# EAGLE design PCB-GONIO-V1.1 (EAGLE 9.6.2)
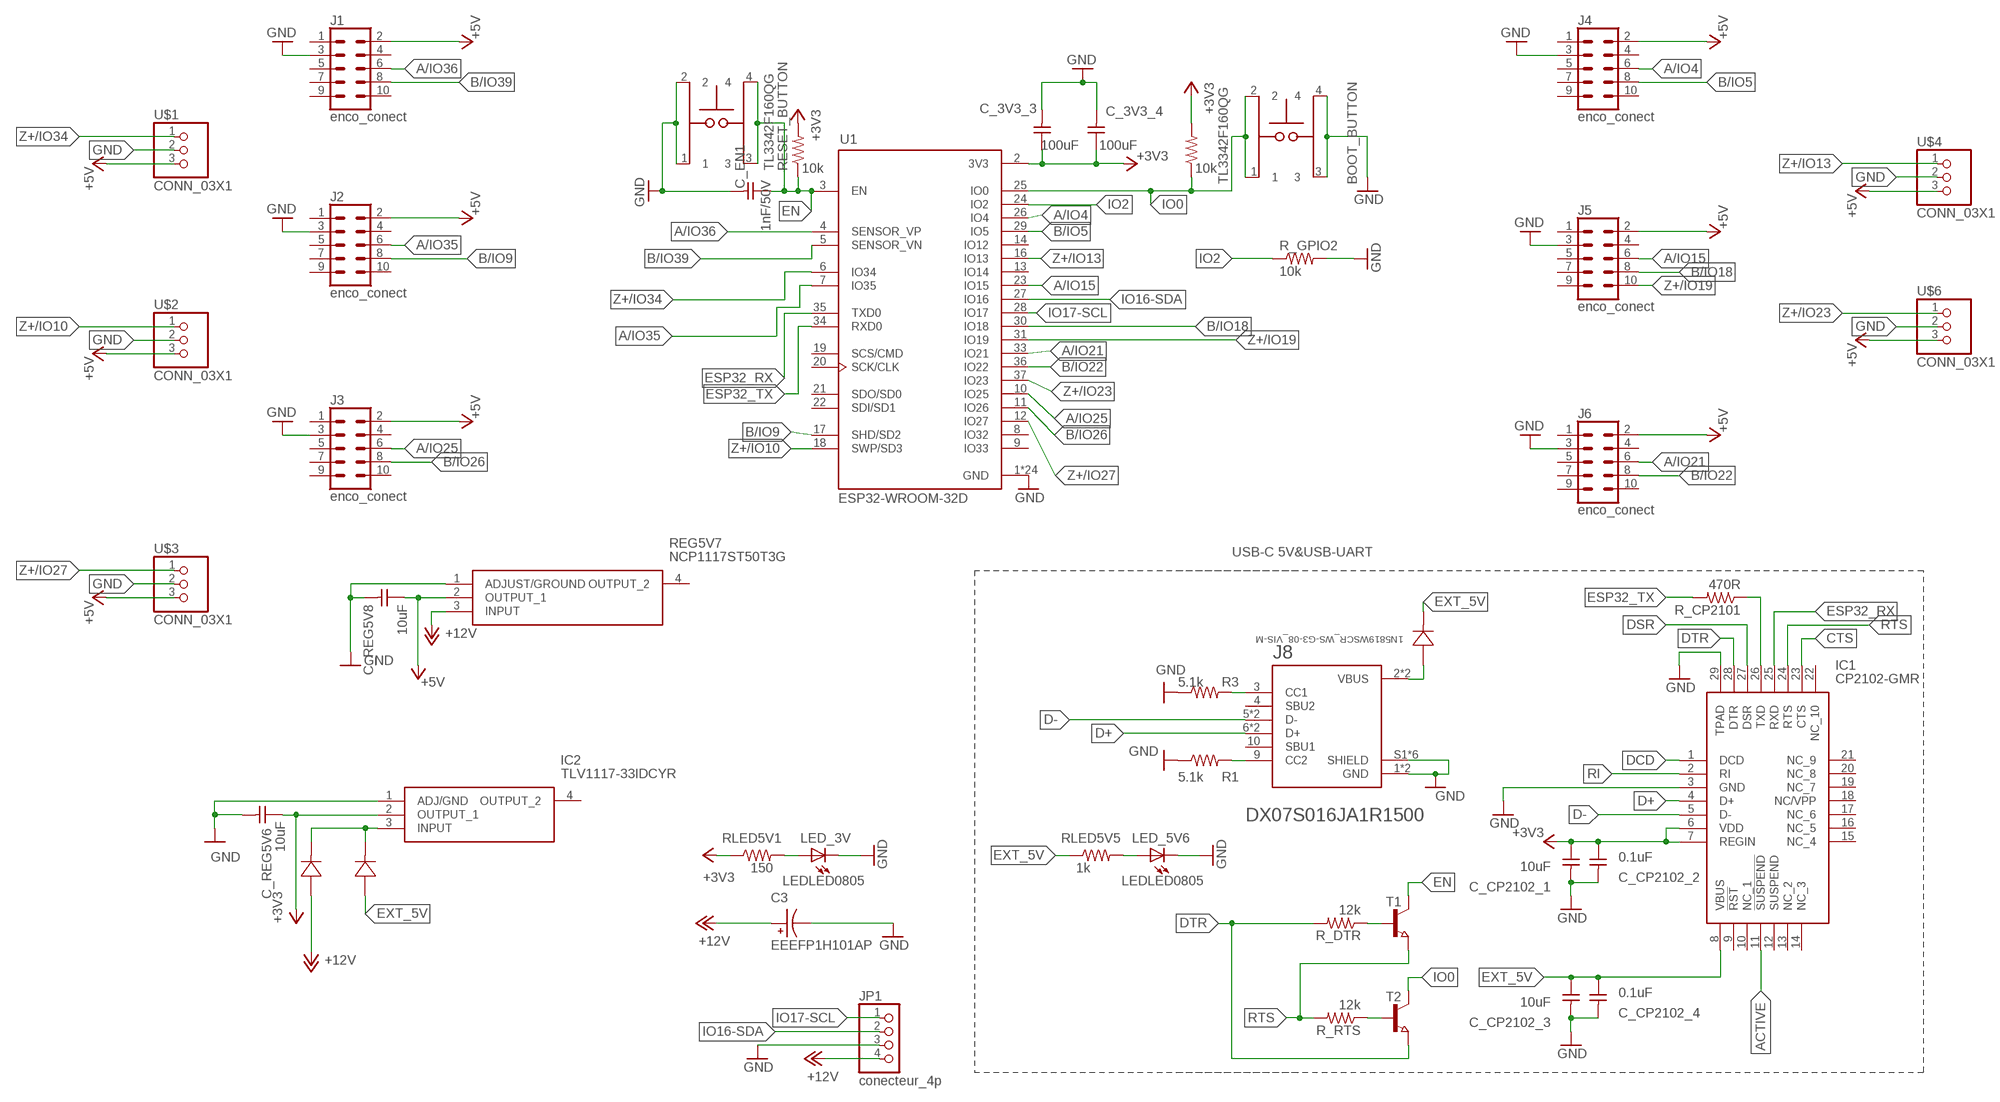
[diagram p0: schematic, sheet 1]

## Parts
BOOT_BUTTON  TL3342F160QG  [SW_TL3342F160QG]
C3  EEEFP1H101AP  [CAP_EEEFP1H101AP]
C_3V3_3  100uF  CAP_UNPOLARIZEDFAB  [C1206FAB]
C_3V3_4  100uF  CAP_UNPOLARIZEDFAB  [C1206FAB]
C_CP2102_1  10uF  CAP_UNPOLARIZEDFAB  [C1206FAB]
C_CP2102_2  0.1uF  CAP_UNPOLARIZEDFAB  [C1206FAB]
C_CP2102_3  10uF  CAP_UNPOLARIZEDFAB  [C1206FAB]
C_CP2102_4  0.1uF  CAP_UNPOLARIZEDFAB  [C1206FAB]
C_EN1  1nF/50V  CAP_UNPOLARIZEDFAB  [C1206FAB]
C_REG5V6  10uF  CAP_UNPOLARIZEDFAB  [C1206FAB]
C_REG5V8  10uF  CAP_UNPOLARIZEDFAB  [C1206FAB]
CR1  1N5819WSCR_WS-G3-08_VIS-M  [CR_WS-G3-08_VIS-M]
CR2  1N5819WSCR_WS-G3-08_VIS-M  [CR_WS-G3-08_VIS-M]
CR3  1N5819WSCR_WS-G3-08_VIS-M  [CR_WS-G3-08_VIS-M]
IC1  CP2102-GMR  [QFN50P500X500X100-29N]
IC2  TLV1117-33IDCYR  [SOT230P700X180-4N]
J1  enco_conect  CONN_05X2SHD  [2X5-SHROUDED]
J2  enco_conect  CONN_05X2SHD  [2X5-SHROUDED]
J3  enco_conect  CONN_05X2SHD  [2X5-SHROUDED]
J4  enco_conect  CONN_05X2SHD  [2X5-SHROUDED]
J5  enco_conect  CONN_05X2SHD  [2X5-SHROUDED]
J6  enco_conect  CONN_05X2SHD  [2X5-SHROUDED]
J8  DX07S016JA1R1500  [JAE_DX07S016JA1R1500]
JP1  conecteur_4p  PINHD-1X4  [1X04]
LED_3V  LEDLED0805  [LEDC2012X90N]
LED_5V6  LEDLED0805  [LEDC2012X90N]
R1  5.1k  R-US_R1206W  [R1206W]
R3  5.1k  R-US_R1206W  [R1206W]
R_CP2101  470R  R1206FAB  [R1206FAB]
R_DTR  12k  R1206FAB  [R1206FAB]
R_GPIO2  10k  R1206FAB  [R1206FAB]
R_PULL_UP1  10k  R1206FAB  [R1206FAB]
R_PULL_UP3  10k  R1206FAB  [R1206FAB]
R_RTS  12k  R1206FAB  [R1206FAB]
REG5V7  NCP1117ST50T3G  [SOT230P700X180-4N]
RESET_BUTTON  TL3342F160QG  [SW_TL3342F160QG]
RLED5V1  150  R1206FAB  [R1206FAB]
RLED5V5  1k  R1206FAB  [R1206FAB]
T1  T_NPN_S8050-J3Y_CHANGJ_SOT23-BEC  [SOT23]
T2  T_NPN_S8050-J3Y_CHANGJ_SOT23-BEC  [SOT23]
U1  ESP32-WROOM-32D  [MODULE_ESP32-WROOM-32D]
U$1  CONN_03X1  [1X3]
U$2  CONN_03X1  [1X3]
U$3  CONN_03X1  [1X3]
U$4  CONN_03X1  [1X3]
U$6  CONN_03X1  [1X3]

## Nets
+3V3: C_3V3_3.1 C_3V3_4.1 C_CP2102_1.1 C_CP2102_2.1 C_REG5V6.1 IC1.6(VDD) IC1.7(REGIN) IC2.2(OUTPUT_1) R_PULL_UP1.2 R_PULL_UP3.2 RLED5V1.1 U1.2(3V3)
+5V: C_REG5V8.1 J1.2 J2.2 J3.2 J4.2 J5.2 J6.2 REG5V7.2(OUTPUT_1) U$1.3 U$2.3 U$3.3 U$4.3 U$6.3
+12V: C3.1 CR2.2 JP1.4 REG5V7.3(INPUT)
A/IO4: J4.6 U1.26(IO4)
A/IO15: J5.6 U1.23(IO15)
A/IO21: J6.6 U1.33(IO21)
A/IO25: J3.6 U1.10(IO25)
A/IO35: J2.6 U1.7(IO35)
A/IO36: J1.6 U1.4(SENSOR_VP)
ACTIVE: IC1.11(!SUSPEND)
B/IO5: J4.8 U1.29(IO5)
B/IO9: J2.8 U1.17(SHD/SD2)
B/IO18: J5.8 U1.30(IO18)
B/IO22: J6.8 U1.36(IO22)
B/IO26: J3.8 U1.11(IO26)
B/IO39: J1.8 U1.5(SENSOR_VN)
CTS: IC1.23(CTS)
D+: IC1.4(D+) J8.6(D+) J8.7(D+)
D-: IC1.5(D-) J8.5(D-) J8.8(D-)
DCD: IC1.1(DCD)
DSR: IC1.27(DSR)
DTR: IC1.28(DTR) R_DTR.2 T2.2(E)
EN: C_EN1.1 R_PULL_UP1.1 RESET_BUTTON.3 RESET_BUTTON.4 T1.3(C) U1.3(EN)
ESP32_RX: IC1.25(RXD) U1.35(TXD0)
ESP32_TX: R_CP2101.2 U1.34(RXD0)
EXT_5V: C_CP2102_3.1 C_CP2102_4.1 CR1.1 CR3.2 IC1.8(VBUS) RLED5V5.1
GND: BOOT_BUTTON.3 BOOT_BUTTON.4 C3.2 C_3V3_3.2 C_3V3_4.2 C_CP2102_1.2 C_CP2102_2.2 C_CP2102_3.2 C_CP2102_4.2 C_EN1.2 C_REG5V6.2 C_REG5V8.2 IC1.3(GND) IC1.29(TPAD) IC2.1(ADJ/GND) J1.3 J2.3 J3.3 J4.3 J5.3 J6.3 J8.1(GND) J8.12(GND) J8.S1(SHIELD) J8.S2(SHIELD) J8.S3(SHIELD) J8.S4(SHIELD) J8.S5(SHIELD) J8.S6(SHIELD) JP1.3 LED_3V.1(C) LED_5V6.1(C) R1.1 R3.1 R_GPIO2.2 REG5V7.1(ADJUST/GROUND) RESET_BUTTON.1 RESET_BUTTON.2 U1.1(GND) U1.15(GND) U1.38(GND) U1.39_1(GND) U1.39_2(GND) U1.39_3(GND) U1.39_4(GND) U1.39_5(GND) U1.39_6(GND) U1.39_7(GND) U1.39_8(GND) U1.39_9(GND) U1.39_10(GND) U1.39_11(GND) U1.39_12(GND) U1.39_13(GND) U1.39_14(GND) U1.39_15(GND) U1.39_16(GND) U1.39_17(GND) U1.39_18(GND) U1.39_19(GND) U1.39_20(GND) U1.39_21(GND) U$1.2 U$2.2 U$3.2 U$4.2 U$6.2
GND1: J8.9(CC2) R1.2
GND3: J8.3(CC1) R3.2
IO0: BOOT_BUTTON.1 BOOT_BUTTON.2 R_PULL_UP3.1 T2.3(C) U1.25(IO0)
IO2: R_GPIO2.1 U1.24(IO2)
IO16-SDA: JP1.2 U1.27(IO16)
IO17-SCL: JP1.1 U1.28(IO17)
N$1: CR2.1 CR3.1 IC2.3(INPUT)
N$2: LED_3V.2(A) RLED5V1.2
N$3: CR1.2 J8.2(VBUS) J8.11(VBUS)
N$8: IC1.26(TXD) R_CP2101.1
N$9: R_DTR.1 T1.1(B)
N$10: R_RTS.1 T2.1(B)
N$19: LED_5V6.2(A) RLED5V5.2
RI: IC1.2(RI)
RTS: IC1.24(RTS) R_RTS.2 T1.2(E)
Z+/IO10: U1.18(SWP/SD3) U$2.1
Z+/IO13: U1.16(IO13) U$4.1
Z+/IO19: J5.10 U1.31(IO19)
Z+/IO23: U1.37(IO23) U$6.1
Z+/IO27: U1.12(IO27) U$3.1
Z+/IO34: U1.6(IO34) U$1.1
Unconnected: IC1.9(!RST) IC1.10(NC_1) IC1.12(SUSPEND) IC1.13(NC_2) IC1.14(NC_3) IC1.15(NC_4) IC1.16(NC_5) IC1.17(NC_6) IC1.18(NC/VPP) IC1.19(NC_7) IC1.20(NC_8) IC1.21(NC_9) IC1.22(NC_10) IC2.4(OUTPUT_2) J1.1 J1.4 J1.5 J1.7 J1.9 J1.10 J2.1 J2.4 J2.5 J2.7 J2.9 J2.10 J3.1 J3.4 J3.5 J3.7 J3.9 J3.10 J4.1 J4.4 J4.5 J4.7 J4.9 J4.10 J5.1 J5.4 J5.5 J5.7 J5.9 J6.1 J6.4 J6.5 J6.7 J6.9 J6.10 J8.4(SBU2) J8.10(SBU1) REG5V7.4(OUTPUT_2) U1.8(IO32) U1.9(IO33) U1.13(IO14) U1.14(IO12) U1.19(SCS/CMD) U1.20(SCK/CLK) U1.21(SDO/SD0) U1.22(SDI/SD1)

## Notes on the sheet
- USB-C 5V&USB-UART

## Library data of the parts
BOOT_BUTTON RESET_BUTTON = TL3342F160QG:TL3342F160QG: Check availability <https://pricing.snapeda.com/parts/TL3342F160QG/E-Switch/view-part?ref=eda>; AVAILABILITY: In Stock; CHECK_PRICES: https://www.snapeda.com/parts/TL3342F160QG/E-Switch/view-part/?ref=eda; DESCRIPTION: Tactile Switch SPST-NO Top Actuated Surface Mount; MF: E-Switch; MP: TL3342F160QG; PACKAGE: None; PRICE: None; SNAPEDA_LINK: https://www.snapeda.com/parts/TL3342F160QG/E-Switch/view-part/?ref=snap
C3 = EEEFP1H101AP:EEEFP1H101AP; CHECK_PRICES: https://www.snapeda.com/parts/EEEFP1H101AP/Panasonic/view-part/?ref=eda; DESCRIPTION: 100µF 50V Aluminum Electrolytic Capacitors Radial, Can - SMD 180mOhm @ 100kHz 2000 Hrs @ 105°C; DIGIKEY_PART_NUMBER: P19726TR-ND; MF: Panasonic; MP: EEEFP1H101AP; PACKAGE: RADIAL-2 Panasonic; SNAPEDA_LINK: https://www.snapeda.com/parts/EEEFP1H101AP/Panasonic/view-part/?ref=snap
C_3V3_3 C_3V3_4 C_CP2102_1-C_CP2102_4 C_EN1 C_REG5V6 C_REG5V8 = fab:CAP_UNPOLARIZED
CR1-CR3 = 1N4148WS:1N5819WS; COPYRIGHT: Copyright (C) 2022 Ultra Librarian. All rights reserved.; DIGI-KEY_PART_NUMBER_1: 1N4148WS-G3-08GITR-ND; DIGI-KEY_PART_NUMBER_2: 1N4148WS-G3-08GICT-ND; DIGI-KEY_PART_NUMBER_3: 1N4148WS-G3-08GIDKR-ND; MANUFACTURER_PART_NUMBER: 1N4148WS-G3-08; MFR_NAME: Vishay
IC1 = SamacSys_Parts:CP2102-GMR: I/O Controller Interface IC USB-TO-UART BRIDGE, qfn-28 Source: Datasheet <https://www.silabs.com/Support Documents/TechnicalDocs/CP2102-9.pdf>; DESCRIPTION: I/O Controller Interface IC USB-TO-UART BRIDGE, qfn-28; HEIGHT: 1mm; MANUFACTURER_NAME: Silicon Labs; MANUFACTURER_PART_NUMBER: CP2102-GMR; MOUSER_PART_NUMBER: 634-CP2102-GMR; MOUSER_PRICE-STOCK: https://www.mouser.co.uk/ProductDetail/Silicon-Labs/CP2102-GMR?qs=cNyzPCcHMUWu%2FiPhR8KQAw%3D%3D
IC2 = TLV1117-33IDCYR:TLV1117-33IDCYR: Single Output LDO, 800mA, Fixed and Adj., Internal Current limit, Thermal Overload Protection Source: Datasheet <https://datasheet.datasheetarchive.com/originals/distributors/Datasheets-DGA25/1767134.pdf>; DESCRIPTION: Single Output LDO, 800mA, Fixed and Adj., Internal Current limit, Thermal Overload Protection; HEIGHT: 1.8mm; MANUFACTURER_NAME: Texas Instruments; MANUFACTURER_PART_NUMBER: TLV1117-33IDCYR; MOUSER_PART_NUMBER: 595-TLV1117-33IDCYR; MOUSER_PRICE-STOCK: https://www.mouser.co.uk/ProductDetail/Texas-Instruments/TLV1117-33IDCYR?qs=p6lVfQR1GSoKgp3tAXcW5w%3D%3D
J1-J6 = fab:CONN_05X2: Multi connection point. Often used as Generic Header-pin footprint for 0.1 inch spaced/style header connections For AVR SPI programming port, see special device with nice symbol: "AVR_SPI_PROG_5x2.dev" You can populate with any combo of single row headers, but if you'd like an exact match, check these: 2x5 AVR ICSP Male Header <https://www.sparkfun.com/products/778> (PRT-00778) 2x5 Pin Shrouded Header <https://www.sparkfun.com/products/8506> (PRT-08506) On any of the 0.1 inch spaced packages, you can populate with these: Break Away Headers - Straight <https://www.sparkfun.com/products/116> (PRT-00116) Break Away Male Headers - Right Angle <https://www.sparkfun.com/products/553> (PRT-00553) Female Headers <https://www.sparkfun.com/products/115> (PRT-00115) Break Away Headers - Machine Pin <https://www.sparkfun.com/products/117> (PRT-00117) Break Away Female Headers - Swiss Machine Pin <https://www.sparkfun.com/products/743> (PRT-00743) Special note: the shrouded connector mates well with our 5x2 ribbon cables: 2x5 Pin IDC Ribbon Cable <https://www.sparkfun.com/products/8535> (PRT-08535); PROD_ID: CONN-08671; SF_ID: PRT-08506
J8 = DX07S016JA1R1500 (2):DX07S016JA1R1500: Check availability <https://pricing.snapeda.com/parts/DX07S016JA1R1500/Japan%20Aviation%20Electronics/view-part?ref=eda>; AVAILABILITY: In Stock; CHECK_PRICES: https://www.snapeda.com/parts/DX07S016JA1R1500/JAE+Electronics/view-part/?ref=eda; DESCRIPTION: USB-C (USB TYPE-C) USB 2.0 Receptacle Connector 24 (16+8 Dummy) Position Surface Mount, Right Angle; Through Hole; MF: Japan Aviation Electronics; MP: DX07S016JA1R1500; PACKAGE: None; PRICE: None; SNAPEDA_LINK: https://www.snapeda.com/parts/DX07S016JA1R1500/JAE+Electronics/view-part/?ref=snap
JP1 = pinhead:PINHD-1X4: PIN HEADER
LED_3V LED_5V6 = fab:LED: LED
R1 R3 = rcl:R-US_: RESISTOR, American symbol; SPICEPREFIX: R
R_CP2101 R_DTR R_GPIO2 R_PULL_UP1 R_PULL_UP3 R_RTS RLED5V1 RLED5V5 = fab:R: Resistor (US Symbol) Variants with postfix FAB are widened to allow the routing of internal traces
REG5V7 = SamacSys_Parts:NCP1117ST50T3G: ON SEMICONDUCTOR - NCP1117ST50T3G - LDO, REG, 20VIN, 1A, 5V, 1%, SOT223-3 Source: Datasheet <http://uk.rs-online.com/web/p/products/8022130P>; ALLIED_NUMBER: 70466898; DESCRIPTION: ON SEMICONDUCTOR - NCP1117ST50T3G - LDO, REG, 20VIN, 1A, 5V, 1%, SOT223-3; HEIGHT: 1.8mm; LCSC_PART: C17314; MANUFACTURER_NAME: ON Semiconductor; MANUFACTURER_PART_NUMBER: NCP1117ST50T3G; RS_PART_NUMBER: 8022130P; RS_PRICE-STOCK: http://uk.rs-online.com/web/p/products/8022130P
T1 T2 = JLC PCB Basic Parts_loc:T_NPN_: Transistor NPN; LCSC_DATASHEET: https://datasheet.lcsc.com/lcsc/1810161230_Changjiang-Electronics-Tech--CJ-S8050-J3Y_C2146.pdf; LCSC_PART: C2146; LCSC_ROTATION_CCW: 180; LCSC_STOCK: 382366; PROPERTIES: 25V 300mW 500mA 200@50mA,1V 150MHz 600mV@500mA,50mA NPN +150°C@(Tj) SOT-23(SOT-23-3) Bipolar Transistors - BJT ROHS
U1 = ESP32-WROOM-32D:ESP32-WROOM-32D: Check availability <https://pricing.snapeda.com/parts/ESP32-WROOM-32D/Espressif%20Systems/view-part?ref=eda>; AVAILABILITY: In Stock; CHECK_PRICES: https://www.snapeda.com/parts/ESP32-WROOM-32D/Espressif+Systems/view-part/?ref=eda; DESCRIPTION: Multiprotocol Modules SMD Module, ESP32-D0WD, 32Mbits SPI flash, UART mode, PCB antenna; MF: Espressif Systems; MP: ESP32-WROOM-32D; PACKAGE: Non Standard Espressif Systems; PRICE: None; SNAPEDA_LINK: https://www.snapeda.com/parts/ESP32-WROOM-32D/Espressif+Systems/view-part/?ref=snap
U$1-U$4 U$6 = fab:CONN_03X1

## Board
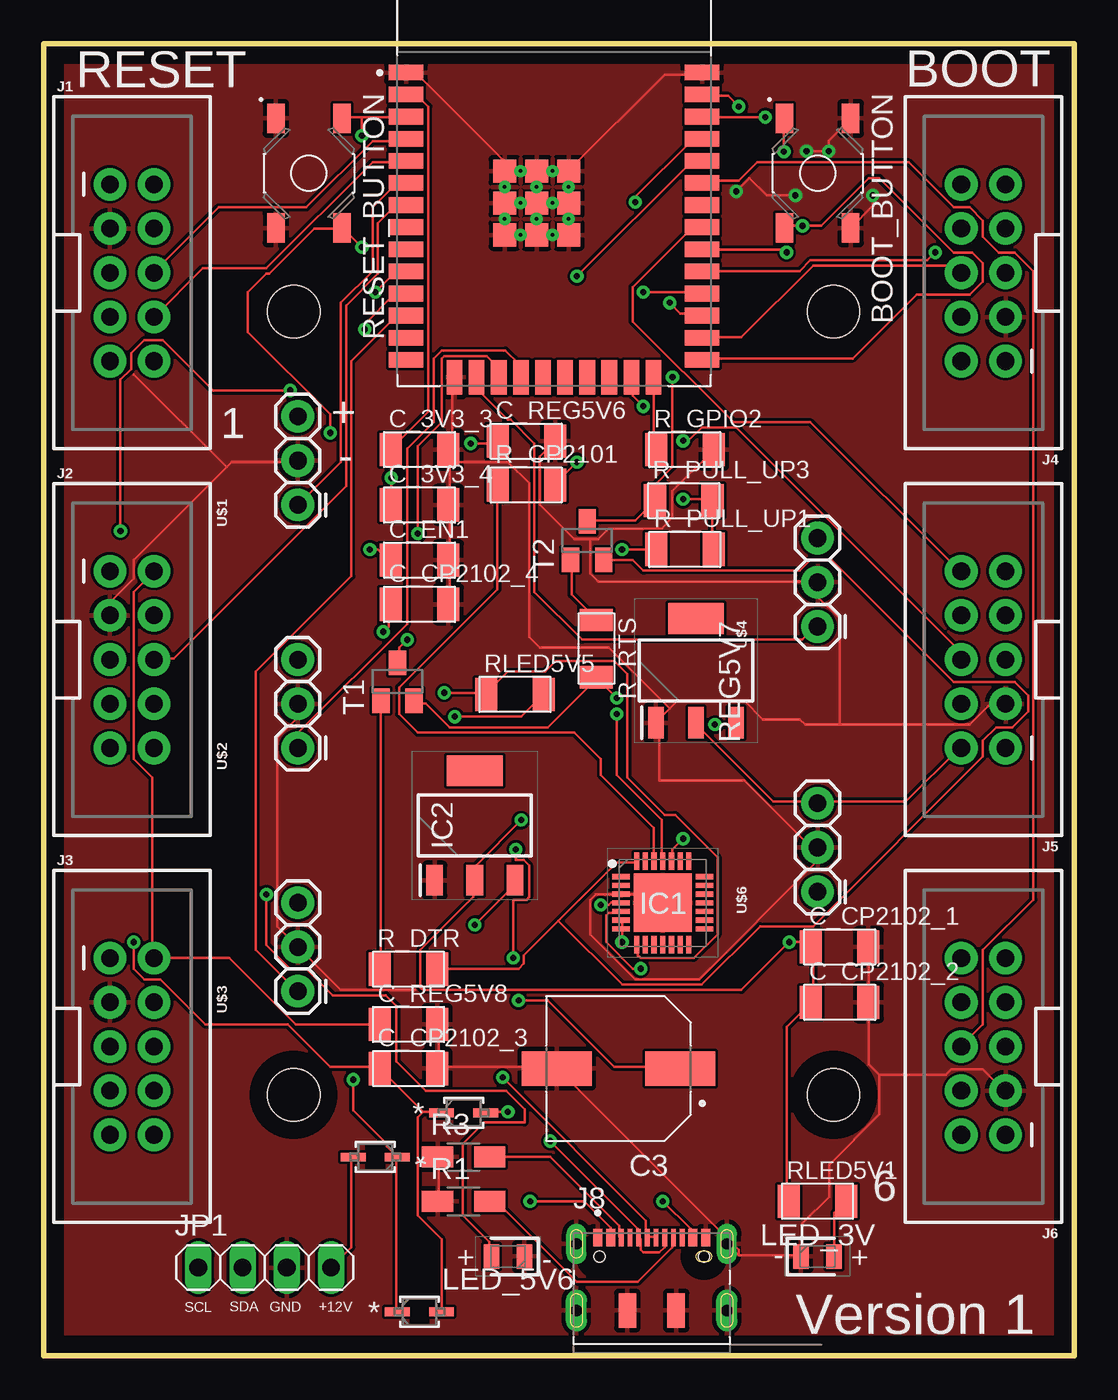
[diagram p1: board, top side]
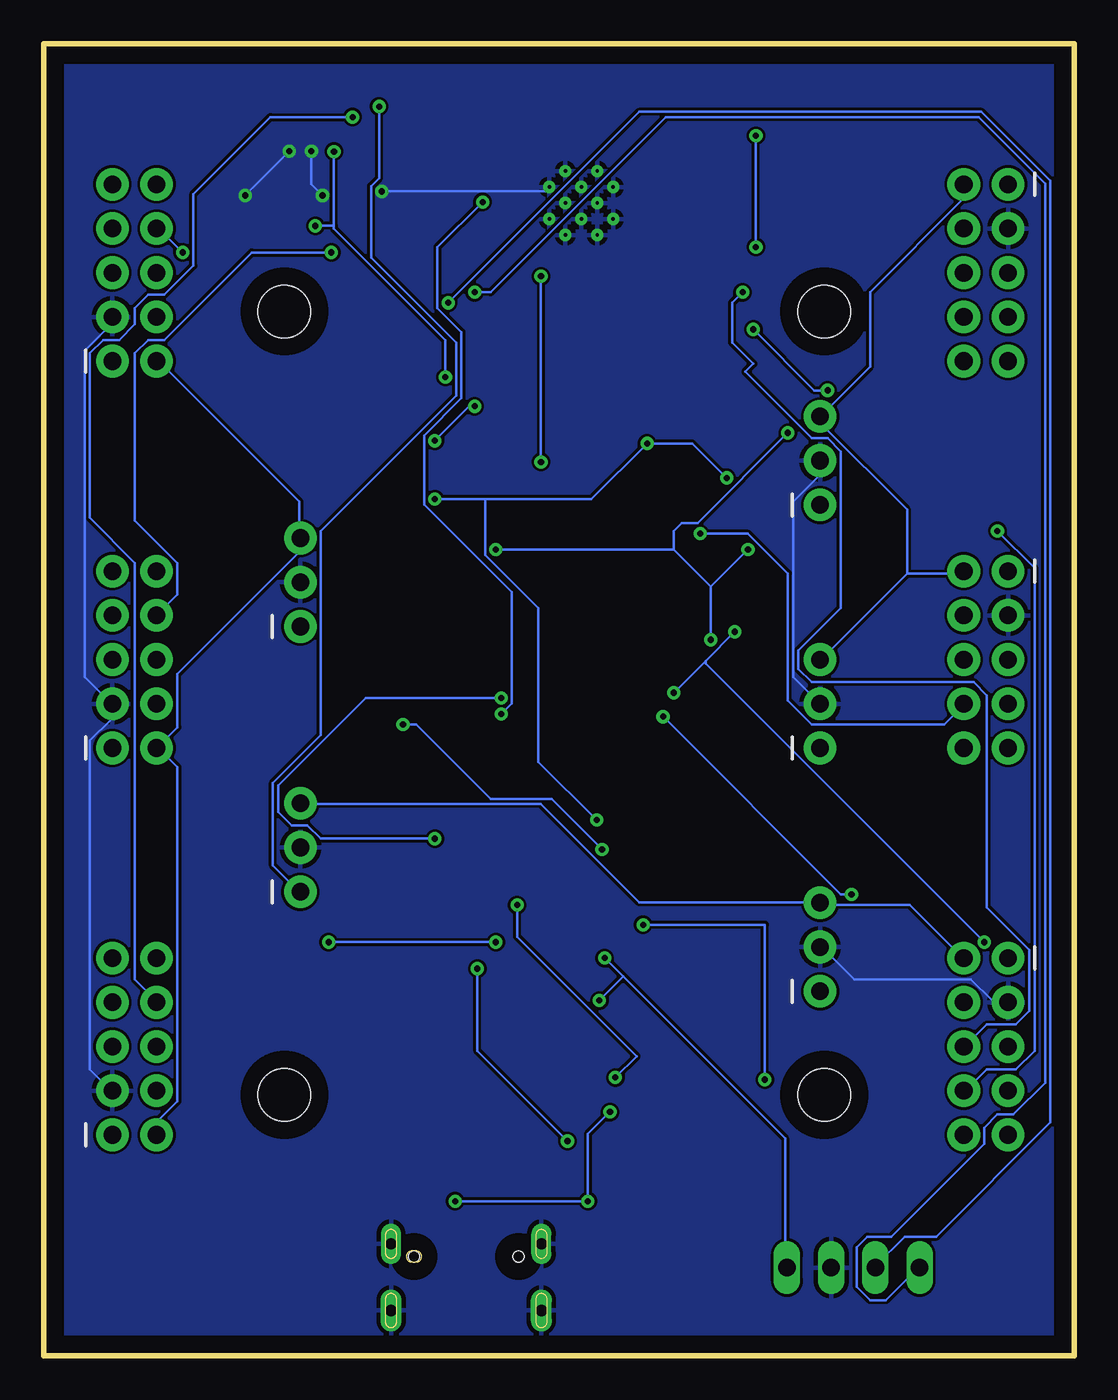
[diagram p2: board, bottom side, seen from below]

Size 59.2 x 75.4 mm. Coordinates in mm from the lower left corner, seen from the top.
Outline: 0,0 59.2,0 59.2,75.4 0,75.4 0,0
Copper layers (1*16): Top 0.035mm / dielectric 1.5mm / Bottom 0.035mm
Design rules "default": minimum track width 6mil, minimum drill 0.35mm, track to track 6mil, track to pad 6mil, pad to pad 6mil, via to via 6mil, smd to smd 6mil, copper to edge 40mil, drill to drill 6mil, minimum pad ring 10mil, minimum via ring 8mil, stop-mask expansion 4mil, vias tented up to drill 0mil, thermal gap 10mil
Holes 3 mm at 14.37,15 14.37,60 45.37,60 45.37,15

### Footprints (pad centres in the part's own frame; a part is rotated, then mirrored left to right if it is on the bottom)
SW_TL3342F160QG = smd 1.7 x 1: 1 -3.15,-1.9; 2 3.15,-1.9; 3 -3.15,1.9; 4 3.15,1.9
CAP_EEEFP1H101AP = smd 4 x 2: 1 -3.55,0; 2 3.55,0
C1206FAB = smd 1.27 x 1.905: 1 -1.651,0; 2 1.651,0
CR_WS-G3-08_VIS-M = smd 1.422 x 0.508: 1 -1.27,0; 2 1.27,0
QFN50P500X500X100-29N = smd 1 x 0.3: 1 -2.4,1.5; 2 -2.4,1; 3 -2.4,0.5; 4 -2.4,0; 5 -2.4,-0.5; 6 -2.4,-1; 7 -2.4,-1.5; 15 2.4,-1.5; 16 2.4,-1; 17 2.4,-0.5; 18 2.4,0; 19 2.4,0.5; 20 2.4,1; 21 2.4,1.5 | smd 0.3 x 1: 8 -1.5,-2.4; 9 -1,-2.4; 10 -0.5,-2.4; 11 0,-2.4; 12 0.5,-2.4; 13 1,-2.4; 14 1.5,-2.4; 22 1.5,2.4; 23 1,2.4; 24 0.5,2.4; 25 0,2.4; 26 -0.5,2.4; 27 -1,2.4; 28 -1.5,2.4 | smd 3.35 x 3.35: 29 0,0
SOT230P700X180-4N = smd 1.75 x 0.95: 1 -3.15,2.3; 2 -3.15,0; 3 -3.15,-2.3 | smd 1.75 x 3.2: 4 3.15,0
2X5-SHROUDED = drill 1.016 pad 1.88: 1 -1.27,5.08; 2 1.27,5.08; 3 -1.27,2.54; 4 1.27,2.54; 5 -1.27,0; 6 1.27,0; 7 -1.27,-2.54; 8 1.27,-2.54; 9 -1.27,-5.08; 10 1.27,-5.08
JAE_DX07S016JA1R1500 = smd 0.52 x 1: 1 -3.1,1.1; 2 -2.35,1.1; 11 2.35,1.1; 12 3.1,1.1 | smd 0.27 x 1: 3 -1.75,1.1; 4 -1.25,1.1; 5 -0.75,1.1; 6 -0.25,1.1; 7 0.25,1.1; 8 0.75,1.1; 9 1.25,1.1; 10 1.75,1.1 | smd 1 x 2: S1 -1.4,-3.1; S2 1.4,-3.1 | drill 0.65 long: S3 -4.32,0.725; S4 4.32,0.725 | drill 0.65 pad 1.2 long: S5 -4.32,-3.1; S6 4.32,-3.1 | hole 0.6: 3,0 | hole 0.63: 3,0; -3,0
1X04 = drill 1.016 long: 1 -3.81,0; 2 -1.27,0; 3 1.27,0; 4 3.81,0
LEDC2012X90N = smd 0.9 x 1.4: 1 -0.95,0; 2 0.95,0
R1206W = smd 1.8 x 1.2: 1 -1.499,0; 2 1.499,0
R1206FAB = smd 1.27 x 1.905: 1 -1.651,0; 2 1.651,0
SOT230P700X180-4N' = smd 1.8 x 0.9: 1 -3,2.3; 2 -3,0; 3 -3,-2.3 | smd 1.8 x 3.2: 4 3,0
SOT23 = smd 1.4 x 1: 1 -1.1,0.95; 2 -1.1,-0.95; 3 1.1,0
MODULE_ESP32-WROOM-32D = smd 2 x 0.9: 1 -8.5,5.26; 2 -8.5,3.99; 3 -8.5,2.72; 4 -8.5,1.45; 5 -8.5,0.18; 6 -8.5,-1.09; 7 -8.5,-2.36; 8 -8.5,-3.63; 9 -8.5,-4.9; 10 -8.5,-6.17; 11 -8.5,-7.44; 12 -8.5,-8.71; 13 -8.5,-9.98; 14 -8.5,-11.25; 25 8.5,-11.25; 26 8.5,-9.98; 27 8.5,-8.71; 28 8.5,-7.44; 29 8.5,-6.17; 30 8.5,-4.9; 31 8.5,-3.63; 32 8.5,-2.36; 33 8.5,-1.09; 34 8.5,0.18; 35 8.5,1.45; 36 8.5,2.72; 37 8.5,3.99; 38 8.5,5.26 | smd 0.9 x 2: 15 -5.715,-12.25; 16 -4.445,-12.25; 17 -3.175,-12.25; 18 -1.905,-12.25; 19 -0.635,-12.25; 20 0.635,-12.25; 21 1.905,-12.25; 22 3.175,-12.25; 23 4.445,-12.25; 24 5.715,-12.25 | smd 1.33 x 1.33: 39_1 -2.835,-0.405; 39_2 -1,-0.405; 39_3 0.835,-0.405; 39_4 -2.835,-2.24; 39_5 -1,-2.24; 39_6 0.835,-2.24; 39_7 -2.835,-4.075; 39_8 -1,-4.075; 39_9 0.835,-4.075 | drill 0.2 pad 0.3: 39_10 -1.917,-0.405; 39_11 -0.083,-0.405; 39_12 -2.835,-1.323; 39_13 -1,-1.323; 39_14 0.835,-1.323; 39_15 -1.917,-2.24; 39_16 -0.083,-2.24; 39_17 -2.835,-3.158; 39_18 -1,-3.158; 39_19 0.835,-3.158; 39_20 -1.917,-4.075; 39_21 -0.083,-4.075
1X3 = drill 1.016 pad 1.88: 1 0,0; 2 2.54,0; 3 5.08,0

### Placement (x,y rotation side)
BOOT_BUTTON  44.45,67.94 270 top
C3  33.02,16.51 180 top
C_3V3_3  21.59,52.07 0 top
C_3V3_4  21.59,48.9 0 top
C_CP2102_1  45.72,23.5 0 top
C_CP2102_2  45.72,20.32 0 top
C_CP2102_3  20.95,16.51 0 top
C_CP2102_4  21.59,43.18 0 top
C_EN1  21.59,45.72 0 top
C_REG5V6  27.73,52.55 0 top
C_REG5V8  20.95,19.05 0 top
CR1  24.13,13.97 0 top
CR2  19.05,11.43 180 top
CR3  21.59,2.54 0 top
IC1  35.56,26.04 0 top
IC2  24.77,30.48 90 top
J1  5.08,62.23 0 top
J2  5.08,40.01 0 top
J3  5.08,17.78 0 top
J4  53.98,62.23 180 top
J5  53.98,40.01 180 top
J6  53.98,17.78 180 top
J8  34.92,5.71 0 top
JP1  12.7,5.08 0 top
LED_3V  44.45,5.71 0 top
LED_5V6  26.67,5.71 180 top
R1  24.13,8.89 0 top
R3  24.13,11.43 0 top
R_CP2101  27.73,50.04 0 top
R_DTR  20.95,22.23 0 top
R_GPIO2  36.83,52.07 0 top
R_PULL_UP1  36.83,46.34 0 top
R_PULL_UP3  36.77,49.14 0 top
R_RTS  31.75,40.64 270 top
REG5V7  NCP1117ST50T3G  [SOT230P700X180-4N']  37.47,39.37 90 top
RESET_BUTTON  15.24,67.94 270 top
RLED5V1  44.45,8.89 0 top
RLED5V5  27.07,38.01 0 top
T1  20.32,38.73 90 top
T2  31.22,46.84 90 top
U1  29.32,68.48 0 top
U$1  14.61,48.9 90 top
U$2  14.61,34.92 90 top
U$3  14.61,20.95 90 top
U$4  44.45,41.91 90 top
U$6  44.45,26.67 90 top

### Tracks (layer width: path | path; a pad name or v marks a point on that pad's centre or on a via)
+3V3  (via drill 0.35)
  Top 0.152: 33.22,24.54 33.22,24.99 IC1.6 | v33.22,23.77 33.22,24.54 | 33.22,24.54 IC1.7 | R_PULL_UP1.2 38.41,46.48 38.41,49.07 R_PULL_UP3.2 38.41,49.23 v36.73,49.23 | C_3V3_4.1 19.96,48.92 v19.96,50.44 19.96,51.97 C_3V3_3.1 19.96,52.12 22.1,54.25 22.1,71.78 21.49,72.39 20.88,72.39 U1.2 | v24.54,52.43 26.06,52.43 C_REG5V6.1 | v27.43,30.79 24.84,28.19 24.84,27.43 IC2.2 24.69,27.28 24.69,26.36 21.64,23.32 21.64,21.18 21.79,21.03 40.08,21.03 v42.82,23.77 43.89,23.77 44.04,23.62 C_CP2102_1.1 44.2,23.47 44.2,20.42 C_CP2102_2.1 44.04,20.27 42.67,18.9 42.67,8.99 RLED5V1.1
  Bottom 0.152: v42.82,23.77 v33.22,23.77 | v19.96,50.44 21.95,52.43 v24.54,52.43 27.74,49.23 33.83,49.23 | 33.83,49.23 v36.73,49.23 | v27.43,30.79 30.79,34.14 30.79,42.98 33.83,46.02 33.83,49.23
+5V
  Top 0.152: REG5V7.2 37.49,36.27 41.91,31.85 44.35,31.85 U$6.3 44.5,31.85 49.53,31.85 52.58,34.9 J5.2 | C_REG5V8.1 14.48,19.05 10.67,22.86 J3.2 6.25,22.86 6.25,33.22 5.18,34.29 5.18,43.89 6.25,44.96 J2.2
  Bottom 0.152: J4.2 52.58,57.15 44.5,49.07 44.5,47.09 U$4.3 44.5,46.94 44.5,46.18 51.51,39.17 51.51,36.12 J5.2 52.58,34.9 51.51,33.83 51.51,14.63 52.58,13.56 52.58,12.8 J6.2 | J3.2 6.4,22.86 9.45,25.91 14.48,25.91 U$3.3 14.63,26.06 24.99,26.06 30.63,31.7 44.35,31.7 U$6.3 | 9.6,44.96 6.4,44.96 J2.2 | 9.6,44.96 14.48,40.08 U$2.3 | 9.6,44.96 9.6,48.62 14.48,53.49 14.48,53.95 U$1.3 11.73,56.84 11.73,61.11 6.4,66.45 | 6.4,66.45 6.4,67.21 J1.2 6.4,66.45
+12V  (via drill 0.35)
  Top 0.152: v26.98,22.86 26.98,26.21 27.74,26.21 27.89,26.36 27.89,28.19 27.58,28.5 27.13,28.5 v27.13,29.11 | v38.56,36.27 39.62,36.27 REG5V7.3 | v27.28,20.42 28.96,20.42 32.77,16.61 36.42,16.61 C3.1 | JP1.4 17.68,6.25 17.68,11.43 CR2.2
  Bottom 0.152: v38.56,36.27 37.8,36.27 33.53,32 30.02,32 v27.13,29.11 | v26.98,22.86 25.91,21.79 | 25.91,21.79 16.61,12.5 16.61,5.18 JP1.4 | 25.91,21.79 v27.28,20.42
A/IO4
  Top 0.152: 52.27,62.64 52.58,62.33 J4.6 52.27,62.64 | U1.26 37.95,58.52 40.08,58.52 44.2,62.64 52.27,62.64
A/IO15  (via drill 0.35)
  Top 0.152: v34.44,54.56 33.83,55.17 33.83,56.08 U1.23 | v36.73,52.58 37.03,52.58 37.8,53.34 39.78,53.34 52.58,40.54 52.58,40.08 J5.6
  Bottom 0.152: v34.44,54.56 34.75,54.56 v36.73,52.58
A/IO21
  Top 0.152: U1.33 37.95,67.51 39.93,67.51 41,68.58 49.68,68.58 52.27,65.99 53.19,65.99 53.95,65.23 53.95,64.31 54.86,63.4 55.78,63.4 56.84,62.33 56.84,26.21 53.95,23.32 53.95,19.05 52.73,17.83 J6.6
A/IO25  (via drill 0.35)
  Top 0.152: v19.05,61.11 20.12,62.18 20.73,62.18 U1.10
  Bottom 0.152: J3.6 6.25,17.83 5.03,19.05 3.35,19.05 2.59,19.81 2.59,23.32 5.03,25.76 5.03,37.95 5.79,38.71 15.09,38.71 15.85,39.47 15.85,40.54 13.41,42.98 13.41,51.97 14.17,52.73 15.09,52.73 18.9,56.54 18.44,57 19.66,58.22 19.66,60.5 v19.05,61.11
A/IO35
  Top 0.152: 20.12,65.99 20.73,65.99 U1.7 20.12,65.99 | J2.6 6.4,40.08 7.47,40.08 17.37,49.99 17.37,60.35 19.2,62.18 19.2,65.08 20.12,65.99
A/IO36
  Top 0.152: 6.86,62.79 6.4,62.33 J1.6 6.86,62.79 | 6.86,62.79 10.06,65.99 15.09,65.99 18.9,69.8 20.73,69.8 U1.4
B/IO5  (via drill 0.35)
  Top 0.152: v51.21,63.4 50.75,62.94 44.04,62.94 43.43,62.33 37.95,62.33 U1.29
  Bottom 0.152: v51.21,63.4 52.58,64.77 J4.8
B/IO9  (via drill 0.35)
  Top 0.152: v21.49,47.24 21.49,52.27 22.86,53.65 22.86,57.3 23.01,57.45 25.45,57.45 26.06,56.84 26.06,56.24 U1.17
  Bottom 0.152: v21.49,47.24 18.75,47.24 16.46,44.96 16.46,37.64 15.09,36.27 7.47,36.27 6.4,37.34 J2.8
B/IO18  (via drill 0.35)
  Top 0.152: v42.67,63.4 42.52,63.55 37.95,63.55 U1.30
  Bottom 0.152: J5.8 51.51,43.74 51.51,45.57 53.95,48.01 53.95,57.61 53.19,58.37 52.27,58.37 47.24,63.4 v42.67,63.4
B/IO22  (via drill 0.35)
  Top 0.152: v41.45,71.17 37.95,71.17 U1.36
  Bottom 0.152: J6.8 52.73,20.42 53.95,21.64 53.95,45.57 56.54,48.16 56.54,57.61 55.78,58.37 54.86,58.37 53.95,59.28 53.95,60.2 53.19,60.96 52.27,60.96 50.6,62.64 50.6,66.75 46.18,71.17 v41.45,71.17
B/IO26  (via drill 0.35)
  Top 0.152: v18.44,58.98 18.44,59.28 20.12,60.96 20.73,60.96 U1.11 | v14.17,55.47 9.75,55.47 6.86,58.37 5.79,58.37 5.03,57.61 5.03,56.69 4.42,56.08 v4.42,47.4
  Bottom 0.152: v4.42,47.4 2.29,45.26 2.29,17.53 3.35,16.46 5.03,16.46 6.25,15.24 J3.8 | v18.44,58.98 14.94,55.47 v14.17,55.47
B/IO39
  Top 0.152: J1.8 9.14,62.48 12.8,62.48 18.9,68.58 20.73,68.58 U1.5
D+  (via drill 0.35)
  Top 0.152: v32,25.91 32.46,25.91 32.61,26.06 33.07,26.06 IC1.4 | J8.7 35.05,6.86 34.75,6.86 J8.6 34.59,6.86 34.59,7.77 v26.36,16
  Bottom 0.152: v26.36,16 25.15,17.22 32,24.08 v32,25.91
D-  (via drill 0.35)
  Top 0.152: IC1.5 33.07,25.45 32.46,25.45 32.31,25.3 32.31,23.77 33.83,22.25 v34.29,22.25 | v29.11,12.34 34.14,7.32 34.14,6.86 J8.5 34.29,6.71 34.29,6.1 34.44,5.94 35.36,5.94 35.66,6.25 35.66,6.71 J8.8
  Bottom 0.152: v34.29,22.25 34.29,17.53 v29.11,12.34
DTR
  Top 0.152: 29.57,24.99 27.58,23.01 27.58,22.55 27.28,22.25 22.71,22.25 R_DTR.2 | 29.57,24.99 32.92,28.35 33.98,28.35 IC1.28 | 29.57,24.99 33.22,21.34 37.8,21.34 41.15,24.69 44.2,24.69 53.95,34.44 53.95,35.36 54.71,36.12 55.63,36.12 56.54,37.03 56.54,37.95 55.78,38.71 52.27,38.71 45.26,45.72 44.04,45.72 43.43,45.11 34.44,45.11 33.83,45.72 32.31,45.72 T2.2
EN  (via drill 0.35)
  Top 0.152: v18.75,46.33 19.2,46.33 19.81,45.72 C_EN1.1 | v20.88,41.15 20.42,40.69 20.42,39.93 T1.3 | v33.22,46.33 35.05,46.33 R_PULL_UP1.1 | 18.29,71.17 20.73,71.17 U1.3 | 18.29,71.17 17.22,71.17 RESET_BUTTON.3 | v18.29,63.7 17.22,64.77 RESET_BUTTON.4 17.07,64.77 15.54,64.77 12.95,62.18 12.8,62.18 11.73,61.11 11.73,58.83 16.46,54.1 v16.46,53.03 | v18.29,70.1 18.29,71.17
  Bottom 0.152: 20.88,44.2 v20.88,41.15 | v18.75,46.33 20.88,44.2 | 23.01,46.33 v33.22,46.33 | 20.88,44.2 23.01,46.33 | 23.01,46.33 23.01,47.4 22.55,47.85 21.64,47.85 v16.46,53.03 | v18.29,63.7 v18.29,70.1
ESP32_RX  (via drill 0.35)
  Top 0.152: v32.92,36.88 32.92,33.38 35.51,30.79 35.51,28.5 IC1.25 | v33.98,66.29 33.98,66.6 37.19,69.8 37.8,69.8 U1.35
  Bottom 0.152: v32.92,36.88 32.31,37.49 32.31,43.89 37.34,48.92 37.34,52.88 35.2,55.02 35.2,58.83 36.58,60.2 36.58,63.7 v33.98,66.29
ESP32_TX  (via drill 0.35)
  Top 0.152: v30.63,51.36 29.41,50.14 R_CP2101.2 | v30.63,62.03 37.19,68.58 37.8,68.58 U1.34
  Bottom 0.152: v30.63,62.03 v30.63,51.36
EXT_5V  (via drill 0.35)
  Top 0.152: IC1.8 34.14,23.62 34.14,23.01 34.29,22.86 37.34,22.86 38.71,24.23 38.71,28.65 36.27,31.09 35.66,31.09 33.53,33.22 33.53,39.17 32.77,39.93 29.41,39.93 28.8,39.32 26.67,39.32 25.45,38.1 RLED5V5.1 25.3,38.1 v23.01,38.1 | v19.51,41.6 19.81,41.91 19.81,43.13 C_CP2102_4.1 | v5.18,23.77 5.18,22.25 5.79,21.64 6.71,21.64 9.3,19.05 14.02,19.05 16.46,16.61 19.2,16.61 C_CP2102_3.1 21.79,14.02 | 21.79,14.02 22.86,14.02 CR1.1 | CR3.2 22.86,6.71 21.49,8.08 21.49,13.72 21.79,14.02
  Bottom 0.152: v23.01,38.1 21.18,39.93 | 21.18,39.93 v19.51,41.6 | v5.18,23.77 21.18,39.78 21.18,39.93
GND  (via drill 0.35)
  Top 0.152: IC1.29 35.51,26.06 35.05,26.52 33.22,26.52 IC1.3 33.07,26.52 31.7,26.52 31.39,26.21 31.39,24.23 33.98,21.64 37.64,21.64 44.35,28.35 44.35,29.11 U$6.2 44.35,29.26 44.04,29.26 40.23,33.07 35.36,33.07 35.36,36.12 35.2,36.27 REG5V7.1 35.2,36.42 35.97,37.19 | 23.32,45.72 23.32,43.28 C_CP2102_4.2 | 23.32,51.36 23.32,51.97 C_3V3_3.2 | 23.32,51.36 23.32,48.92 C_3V3_4.2 23.32,48.77 23.32,45.72 | U1.15 23.47,56.08 23.47,52.27 23.32,52.12 C_3V3_3.2 | 23.32,45.72 C_EN1.2 | 31.39,46.94 30.48,46.94 28.5,48.92 28.5,51.66 29.26,52.43 C_REG5V6.2 | 31.39,46.94 31.85,46.94 32.46,47.55 35.51,47.55 36.12,48.16 36.12,49.68 38.41,51.97 R_GPIO2.2 | 35.97,37.19 36.42,37.64 40.23,37.64 41.3,36.58 43.43,36.58 43.74,36.27 45.72,36.27 | 35.97,37.19 32.46,40.69 28.5,40.69 27.89,41.3 27.89,50.14 26.67,51.36 23.32,51.36 | 45.72,36.27 53.19,36.27 54.25,37.34 55.17,37.34 J5.3 | 45.72,36.27 45.72,42.37 44.5,43.59 44.5,44.35 U$4.2 44.35,44.5 31.85,44.5 31.39,44.96 31.39,46.94 | 23.32,51.36 C_3V3_3.2 | C_CP2102_1.2 47.4,23.47 47.4,20.42 C_CP2102_2.2 47.4,20.27 47.4,16.76 48.01,16.15 | 37.95,73.61 U1.38 37.8,73.61 35.66,73.61 30.18,68.12 U1.39_3 30.02,68.12 29.26,68.12 U1.39_11 29.11,68.12 28.35,68.12 U1.39_2 28.19,68.12 27.43,68.12 U1.39_10 27.28,68.12 26.52,68.12 U1.39_1 | U1.39_13 28.35,67.06 28.35,66.29 U1.39_5 28.19,66.29 27.43,66.29 U1.39_15 27.28,66.29 26.52,66.29 | 28.35,64.47 28.35,65.23 U1.39_18 | 26.52,64.47 26.52,65.23 U1.39_17 26.52,65.38 26.52,66.14 U1.39_4 26.52,66.29 | 26.52,66.29 26.52,67.06 U1.39_12 26.52,67.21 26.52,67.97 U1.39_1 | 26.52,64.47 27.28,64.47 U1.39_20 27.43,64.47 28.19,64.47 U1.39_8 28.35,64.47
  Top 0.152: 26.52,64.47 U1.39_7 | 28.35,64.47 29.11,64.47 U1.39_21 29.26,64.47 30.02,64.47 U1.39_9 30.18,64.47 30.18,65.23 U1.39_19 30.18,65.38 30.18,66.14 U1.39_6 | v39.78,66.9 40.54,67.67 41.53,66.67 v43.18,66.67 | U1.39_6 30.18,66.29 30.18,67.06 U1.39_14 | U1.39_16 29.26,66.29 30.02,66.29 U1.39_6 | 20.73,73.61 U1.1 20.88,73.61 21.49,73.61 26.36,68.73 26.36,68.12 U1.39_1 | 22.71,16.61 22.71,19.05 C_REG5V8.2 22.55,19.05 | J2.3 3.81,43.28 5.18,44.65 5.18,45.72 10.52,51.05 | 10.52,51.05 10.82,51.36 14.48,51.36 U$1.2 | U$2.2 14.48,37.34 14.48,36.58 13.41,35.51 13.41,24.69 U$3.2 17.07,21.03 21.34,21.03 | 10.52,51.05 5.18,56.39 | R1.1 22.71,8.99 22.71,11.43 R3.1 | 22.71,16.61 29.41,16.61 C3.2 29.57,16.46 | 22.71,16.61 C_CP2102_3.2 | 27.74,5.64 LED_5V6.1 27.58,5.64 | 39.93,5.79 43.43,5.79 LED_3V.1 43.59,5.79 43.59,7.62 45.11,9.14 45.11,10.97 48.01,13.87 48.01,16.15 | 33.53,2.74 J8.S1 33.38,2.59 | 36.27,2.74 J8.S2 36.42,2.59 | 29.57,16.15 29.57,16.46 | 48.01,16.15 51.82,16.15 52.12,16.46 53.95,16.46 55.17,15.24 J6.3 | 39.93,5.79 39.32,6.4 J8.S4 | 39.93,5.79 39.93,6.1 29.57,16.46 | BOOT_BUTTON.4 47.62,66.07 v47.62,66.67 | BOOT_BUTTON.3 45.09,69.83 v45.09,69.22 v43.81,69.22
  Bottom 0.152: J4.3 55.32,59.59 55.32,59.28 56.84,57.76 56.84,39.01 55.32,37.49 J5.3 55.32,37.34 55.32,36.58 56.54,35.36 56.54,16.46 55.32,15.24 J6.3 | v39.78,66.9 30.33,66.9 30.18,67.06 U1.39_14 | J3.3 3.81,20.42 4.72,20.42 5.94,21.64 12.65,21.64 14.48,23.47 U$3.2 | U$2.2 16.15,39.01 16.15,49.07 14.63,50.6 14.63,51.36 U$1.2 | 30.48,6.4 J8.S3 | v47.62,66.67 v45.09,69.22 | v43.81,69.22 43.81,67.31 v43.18,66.67
  pour Top: -0.64,76.2 59.69,76.2 59.69,-0.64 -0.64,-0.64
  pour Bottom: -0.64,76.2 59.69,76.2 59.69,-0.64 -0.64,-0.64
GND1
  Top 0.152: J8.9 36.12,6.71 36.12,6.25 34.14,4.27 30.63,4.27 26.06,8.84 25.76,8.84 R1.2
GND3
  Top 0.152: R3.2 29.11,11.43 33.07,7.47 33.07,6.86 J8.3
IO0  (via drill 0.35)
  Top 0.152: T2.3 31.24,48.01 33.98,48.01 R_PULL_UP3.1 35.2,49.23 35.2,50.14 36.12,51.05 v36.12,56.24 | U1.25 37.95,57.3 46.48,57.3 50.14,60.96 53.19,60.96 53.95,61.72 53.95,62.79 53.34,63.4 52.27,63.4 48.01,67.67 47.4,67.67 44.65,64.92 v43.59,64.92 42.67,64.92 BOOT_BUTTON.2 | v42.52,69.19 42.52,71.02 BOOT_BUTTON.1
  Bottom 0.152: v36.12,56.24 36.12,58.37 42.52,64.77 42.52,64.92 | 42.52,64.92 v42.52,69.19 | 42.52,64.92 v43.59,64.92
IO2
  Top 0.152: R_GPIO2.1 35.05,52.12 35.05,56.08 U1.24
IO16-SDA  (via drill 0.35)
  Top 0.152: v35.97,60.5 36.58,59.89 37.8,59.89 U1.27
  Bottom 0.152: v35.97,60.5 24.99,71.48 5.33,71.48 1.37,67.51 1.37,13.41 7.92,6.86 9.75,6.86 11.43,5.18 JP1.2
IO17-SCL  (via drill 0.35)
  Top 0.152: v34.44,61.11 37.8,61.11 U1.28
  Bottom 0.152: v34.44,61.11 33.53,61.11 23.47,71.17 5.49,71.17 1.68,67.36 1.68,15.7 3.5,13.87 4.42,13.87 5.18,13.11 5.18,12.19 10.52,6.86 11.89,6.86 12.5,6.25 12.5,3.96 11.73,3.2 10.82,3.2 8.99,5.03 JP1.1
N$1  (via drill 0.35)
  Top 0.152: CR3.1 20.27,2.59 20.27,11.43 CR2.1 19.71,12.04 19.71,12.19 17.78,14.12 v17.78,15.88 | v24.77,24.77 27.07,27.07 IC2.3
  Bottom 0.152: v17.78,15.88 17.78,24.77 v24.77,24.77
N$2
  Top 0.152: LED_3V.2 45.41,5.79 45.41,8.23 46.02,8.84 RLED5V1.2
N$3  (via drill 0.35)
  Top 0.152: CR1.2 25.45,14.02 v26.67,14.02 | v27.94,8.89 31.05,8.89 32.56,7.38 32.56,6.83 J8.2 | v35.56,8.89 37.16,7.29 37.16,6.93 J8.11
  Bottom 0.152: v26.67,14.02 27.94,12.75 v27.94,8.89 v35.56,8.89
N$8
  Top 0.152: IC1.26 35.05,28.5 35.05,30.33 32,33.38 32,34.29 30.48,35.81 21.49,35.81 20.42,36.88 20.42,38.41 26.06,44.04 26.06,49.99 R_CP2101.1
N$9
  Top 0.152: T1.1 19.36,37.49 19.36,22.25 R_DTR.1
N$10
  Top 0.152: T2.1 30.33,45.72 30.33,43.74 31.7,42.37 R_RTS.1
N$19  (via drill 0.35)
  Top 0.152: v12.8,26.52 12.8,23.62 14.17,22.25 15.09,22.25 16.61,20.73 19.66,20.73 20.27,20.12 20.27,16.92 21.95,15.24 26.58,15.24 27.64,14.18 27.64,13.41 25.3,13.41 24.08,12.19 24.08,8.08 25.6,6.55 25.6,5.79 LED_5V6.2 | v23.62,36.73 27.43,36.73 28.65,37.95 RLED5V5.2
  Bottom 0.152: v12.8,26.52 13.41,26.52 v23.62,36.73
RTS  (via drill 0.35)
  Top 0.152: v36.73,29.72 36.12,29.11 36.12,28.5 IC1.24 | v32.92,37.8 31.85,38.86 R_RTS.2 31.7,38.86 28.96,36.12 23.32,36.12 21.95,37.49 21.34,37.49 T1.2
  Bottom 0.152: v36.73,29.72 43.28,29.72 44.04,30.48 44.96,30.48 45.72,31.24 45.72,32.77 40.69,37.8 v32.92,37.8
Z+/IO10
  Top 0.152: U1.18 27.28,56.24 27.28,57 26.52,57.76 22.86,57.76 22.4,57.3 22.4,53.65 20.88,52.12 20.88,42.06 14.63,35.81 14.63,35.05 U$2.1
Z+/IO13
  Top 0.152: U1.16 24.99,56.08 24.99,55.47 26.67,53.8 26.82,53.8 28.19,52.43 28.19,43.89 30.94,41.15 43.59,41.15 44.35,41.91 U$4.1
Z+/IO19
  Top 0.152: U1.31 37.8,64.77 37.19,64.77 33.83,61.42 33.83,59.44 39.62,53.65 44.04,53.65 52.58,45.11 J5.10
Z+/IO23  (via drill 0.35)
  Top 0.152: U1.37 37.95,72.39 39.32,72.39 v39.93,71.78
  Bottom 0.152: U$6.1 44.5,26.67 46.02,28.19 46.02,32.92 43.28,35.66 43.28,47.4 35.51,55.17 35.51,58.22 40.39,63.09 40.39,67.21 39.93,67.67 v39.93,71.78
Z+/IO27
  Top 0.152: U1.12 20.73,59.74 20.27,59.74 17.68,57.15 17.68,44.81 12.19,39.32 12.19,23.32 14.48,21.03 U$3.1
Z+/IO34
  Top 0.152: 20.27,67.36 20.73,67.36 U1.6 20.27,67.36 | U$1.1 17.07,51.36 17.07,60.5 18.9,62.33 18.9,65.99 20.27,67.36

### Text on the board
tPlace: RESET | BOOT | 1 | + | - | 6 | SCL | SDA | GND | +12V | Version 1